# EAGLE design ir2184_smd (EAGLE 9.6.2)
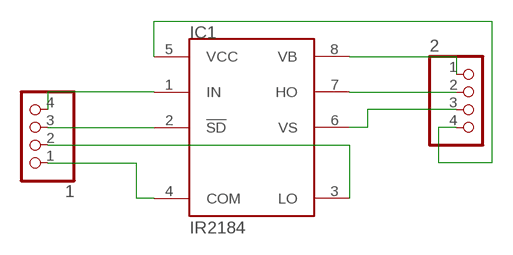
[diagram p0: schematic, sheet 1]

## Parts
1  PINHD-1X4  [1X04]
2  PINHD-1X4  [1X04]
IC1  IR2184  [SO08]

## Nets
COM: 1.1 IC1.4(COM)
N$1: 1.4 IC1.1(IN)
N$2: 1.3 IC1.2(!SD)
N$4: 2.2 IC1.7(HO)
N$5: 1.2 IC1.3(LO)
VB: 2.1 IC1.8(VB)
VCC: 2.4 IC1.5(VCC)
VS: 2.3 IC1.6(VS)

## Library data of the parts
1 2 = pinhead:PINHD-1X4: PIN HEADER
IC1 = MIA_LIBRARY-2-2-2:IR2184

## Board
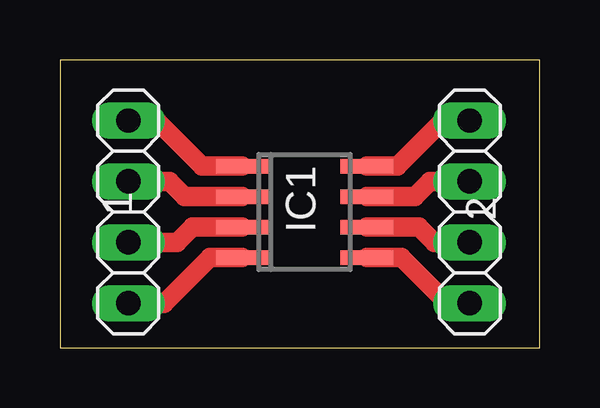
[diagram p1: board, top side]

Size 20 x 12 mm. Coordinates in mm from the lower left corner, seen from the top.
Outline: 0,0 20,0 20,12 0,12 0,0
Copper layers (1*16): Top 0.035mm / dielectric 1.5mm / Bottom 0.035mm
Design rules "default *": minimum track width 6mil, minimum drill 0.35mm, track to track 0.4mm, track to pad 0.4mm, pad to pad 6mil, via to via 6mil, smd to smd 6mil, copper to edge 40mil, drill to drill 6mil, minimum pad ring 10mil, minimum via ring 8mil, stop-mask expansion 4mil, vias tented up to drill 0mil, thermal gap 10mil

### Footprints (pad centres in the part's own frame; a part is rotated, then mirrored left to right if it is on the bottom)
1X04 = drill 1.016 long: 1 -3.81,0; 2 -1.27,0; 3 1.27,0; 4 3.81,0
SO08 = smd 0.6 x 2.2: 1 -1.905,-2.6; 2 -0.635,-2.6; 3 0.635,-2.6; 4 1.905,-2.6; 5 1.905,2.6; 6 0.635,2.6; 7 -0.635,2.6; 8 -1.905,2.6

### Placement (x,y rotation side)
1  2.85,5.66 90 top
2  17.09,5.66 270 top
IC1  10.2,5.66 270 top

### Tracks (layer width: path | path; a pad name or v marks a point on that pad's centre or on a via)
COM
  Top 0.813: 1.1 4.35,1.85 6.25,3.75 IC1.4
N$1
  Top 0.813: IC1.1 5.93,7.57 4,9.5 2.88,9.5 1.4
N$2
  Top 0.813: 1.3 4.57,6.93 5.21,6.29 IC1.2
N$4
  Top 0.813: IC1.7 14.79,6.29 15.43,6.93 2.2
N$5
  Top 0.813: 1.2 4.89,4.39 5.53,5.03 IC1.3
VB
  Top 0.813: IC1.8 14.06,7.57 15.97,9.47 2.1
VCC
  Top 0.813: IC1.5 14.24,3.75 16.15,1.85 2.4
VS
  Top 0.813: IC1.6 14.97,5.03 15.61,4.39 2.3